# EasyEDA Pro project 三轴测试仪快速检测系统_2024-12-14.eprj, board PCB1
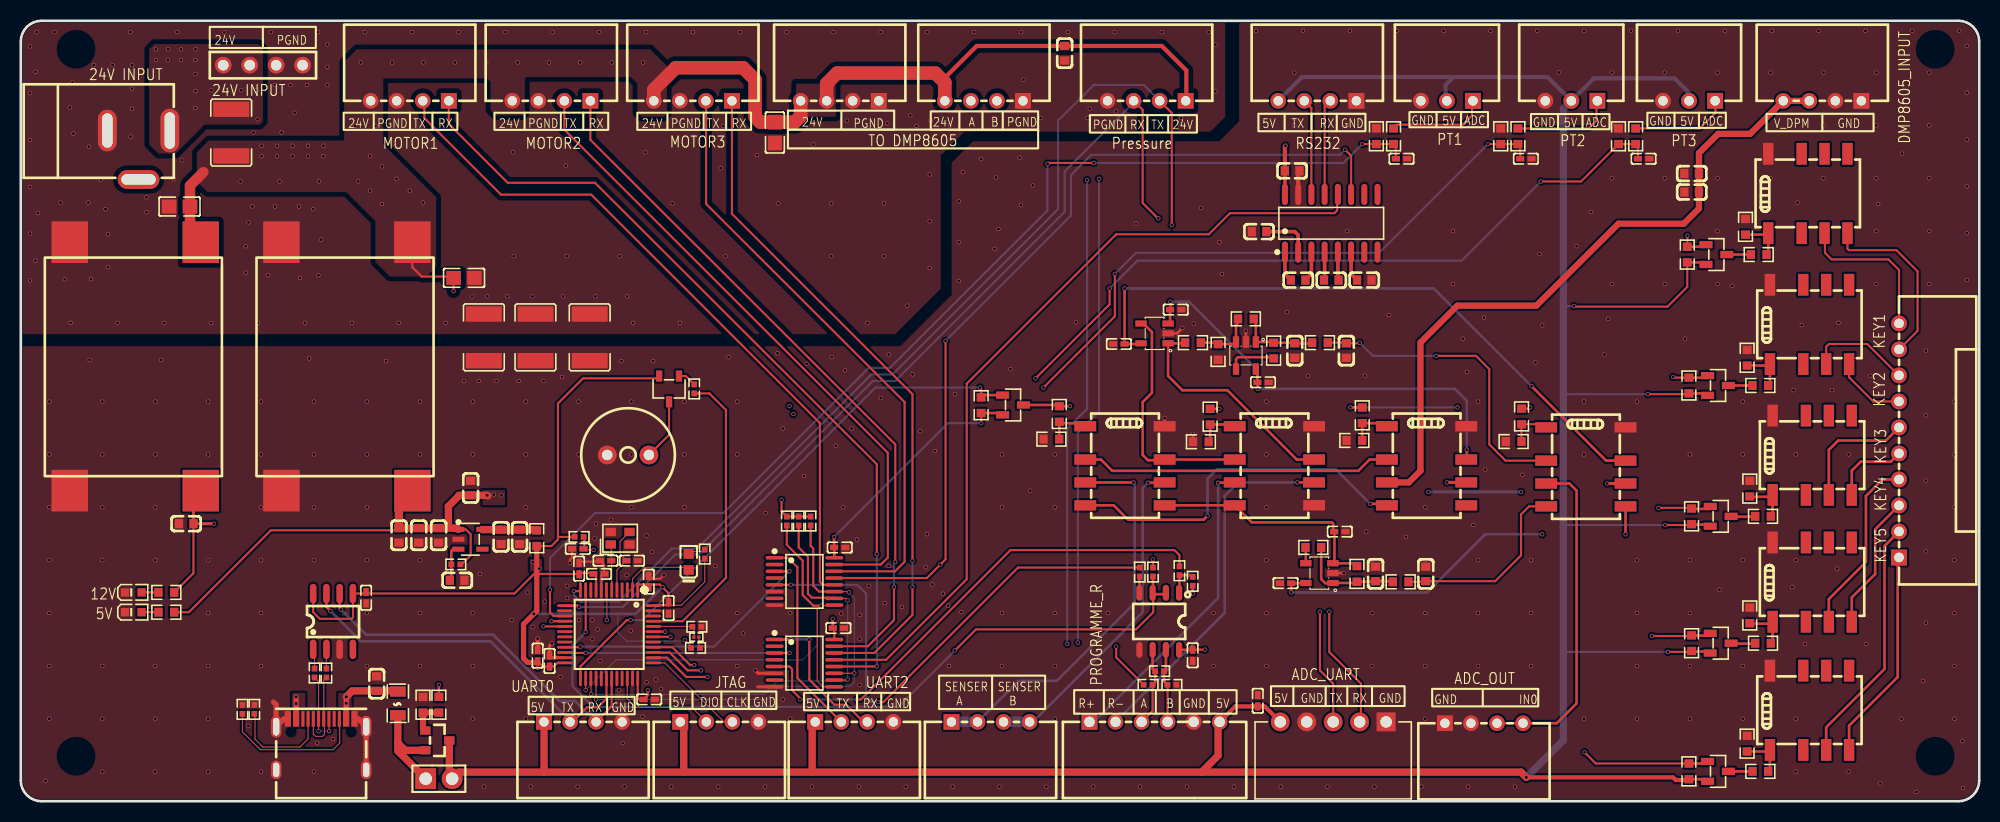
[diagram p6: board, top side]
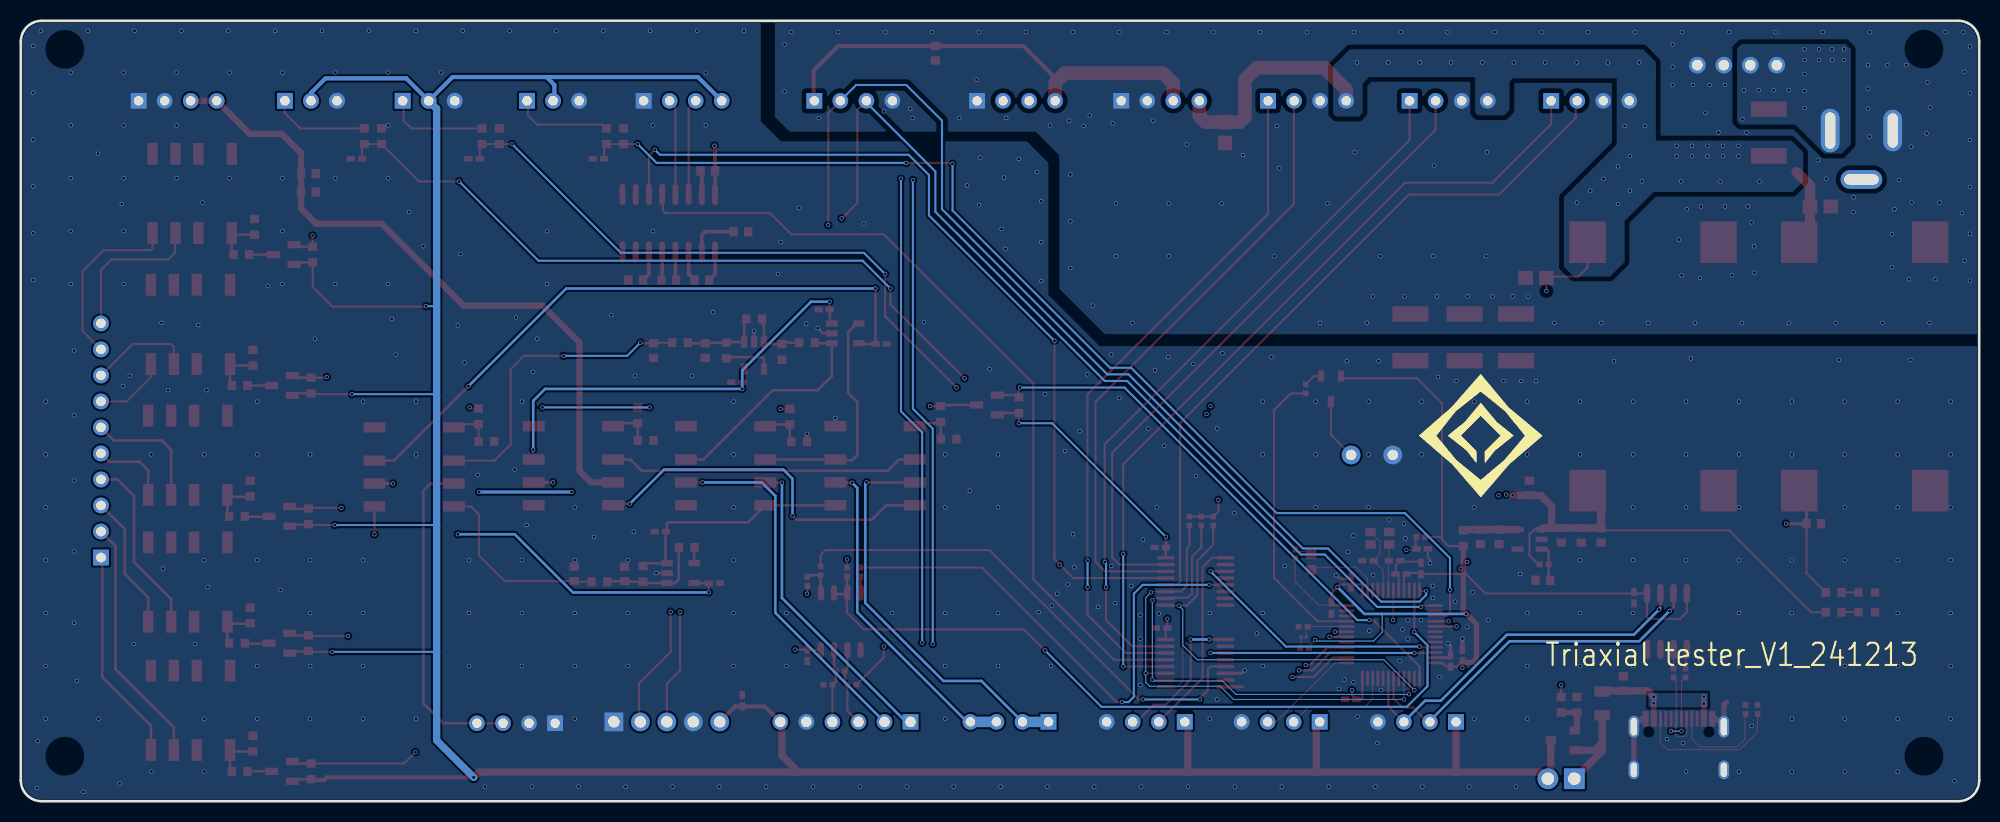
[diagram p7: board, bottom side, seen from below]

Outline 188 x 75 mm; copper layers: Top Layer, Inner1, Inner2, Bottom Layer. Coordinates in mm from the lower left corner of the outline.
Outline path: 0,73 0,2 arc(0.59,0.59) 2,0 186,0 arc(187.41,0.59) 188,2 188,73 arc(187.41,74.41) 186,75 2,75 arc(0.59,74.41) 0,73
Stack: Top Layer 0.035mm 外层铜厚1oz / Dielectric1 0.2104mm 7628 RC49% 8.6mil / Inner1 0.0152mm 内层铜厚 / Dielectric2 1.065mm 1.1mm H/HOZ Copper / Inner2 0.0152mm 内层铜厚 / Dielectric3 0.2104mm 7628 RC49% 8.6mil / Bottom Layer 0.035mm 外层铜厚1oz

## Design rules (mm)
template: 自定义配置
spacing copperThickness1oz (default): track to track 0.102, other pairs 0.152 to 0.3
spacing copperThickness2oz: track to track 0.203, other pairs 0.152 to 0.3
track width copperThickness1oz (default): min 0.09, default 0.2, max 4
track width copperThickness2oz: min 0.203, default 0.254, max 2.54
differential pair differentialPair (default): width min 0.127, default 0.254, max 2.54; gap min 0.152, default 0.152
via viaSize (default): diameter min 0.3, default 0.405, max 10; hole min 0.3, default 0.305, max 6.3
net GND uses PGND
net PGND uses PGND-爬电
net $3N960 uses PGND-爬电

## Placement (name value [footprint] x y rotation side)
BUZZER1  2.7kHz  [BUZ-TH_BD9.0-P4.00-D0.6-FD]  58.29 33.27 180 top
C101  100nF  [C0402]  105.41 43.94 0 top
C102  100nF  [C0402]  119.25 40.26 180 top
C103  100nF  [C0402]  110.87 47.24 180 top
C104  100nF  [C0603]  122.3 43.31 90 top
C105  100nF  [C0603]  127.25 43.31 90 top
C106  100nF  [C0402]  121.41 20.95 0 top
C107  100nF  [C0603]  130.05 21.84 270 top
C108  100nF  [C0603]  134.87 21.84 270 top
C201  100nF  [C0402]  78.61 24.38 0 top
C202  100nF  [C0402]  112.5 14.02 90 top
C203  100nF  [C0402]  78.49 16.64 0 top
C204  220nF  [C0603]  122.05 60.58 0 top
C205  220nF  [C0603]  118.87 54.74 0 top
C206  220nF  [C0603]  122.62 50.08 180 top
C207  220nF  [C0603]  125.8 50.08 180 top
C208  220nF  [C0603]  128.97 50.08 0 top
C301  10nF  [C0603]  40.11 25.55 270 top
C302  10uF  [C0603]  36.3 25.55 270 top
C303  100nF  [C0603]  38.2 25.55 270 top
C304  10uF  [C0603]  46.1 25.4 270 top
C305  100nF  [C0603]  47.88 25.4 270 top
C306  2.2uF  [C0603]  41.89 21.23 180 top
C401  100nF  [C0402]  60.28 21.1 270 top
C402  100nF  [C0402]  62.19 18.56 270 top
C403  1uF  [C0402]  53.59 22.35 270 top
C404  10nF  [C0402]  55.5 21.84 180 top
C405  100nF  [C0402]  60.33 9.78 180 top
C406  4.7uF  [C0402]  49.61 13.99 270 top
C407  100nF  [C0402]  50.75 13.48 270 top
C408  20pF  [C0402]  58.67 23.11 0 top
C409  20pF  [C0402]  56.13 23.11 0 top
C410  100nF  [C0402]  53.47 24.26 0 top
C501  100nF  [C0603]  34.16 11.3 90 top
C502  100nF  [C0402]  33.15 19.56 90 top
C503  100nF  [C0402]  132.54 61.75 180 top
C504  100nF  [C0805]  42.55 50.29 180 top
C505  100nF  [C0603]  43.18 30.1 270 top
C506  100nF  [C0603]  100.2 71.88 270 top
C507  100nF  [C0402]  118.75 9.65 90 top
C508  100nF  [C0603]  160.4 58.55 180 top
C509  10nF  [C0603]  160.4 60.33 180 top
C510  100nF  [C0603]  15.88 26.67 0 top
C511  100nF  [C0805]  15.24 57.15 0 top
C512  100nF  [C0402]  144.48 61.75 180 top
C513  100nF  [C0402]  155.79 61.75 180 top
C514  10uF  [C0805]  72.39 64.26 270 top
C515  100nF  [C0402]  126.62 25.91 0 top
CN2  ZX-HA2.54-10PWZ  [CONN-TH_10P-P2.50_ZX-HA2.54-10PWZ]  180.31 34.67 90 top
D401  绿灯 0603  [0603_LED_S1]  64.12 22.99 90 top
D402  XL-1608PGC-06  [LED0603-RD_GREEN]  10.8 20.07 0 top
D403  XL-1608PGC-06  [LED0603-RD_GREEN]  10.8 18.16 0 top
DC302  DC-005-5A-2.5  [DC-IN-TH_DC-005-5A-2.5]  11.3 62.1 0 top
F501  SL0805150 6V 1.5A  [F0805]  36.2 9.4 90 top
H501  WAFER-XH2.54-3PWZ  [CONN-TH_3P-P2.50_WAFER-XH2.54-3PWZ]  136.91 67.31 180 top
H502  PZ254V-11-02P  [HDR-TH_2P-P2.54-V-M]  40.13 2.16 0 top
H503  XH-5AW  [CONN-TH_5P-P2.54_XH-5AW_C2908614]  125.98 7.62 180 top
H504  ZX-XH2.54-6PWZ  [CONN-TH_6P-P2.50_ZX-XH2.54-6PWZ]  108.84 7.62 0 top
H505  WAFER-XH2.54-3PWZ  [CONN-TH_3P-P2.50_WAFER-XH2.54-3PWZ]  148.84 67.31 180 top
H506  WAFER-XH2.54-3PWZ  [CONN-TH_3P-P2.50_WAFER-XH2.54-3PWZ]  160.15 67.31 180 top
K101  G6K-2F-Y-TR DC5  [RELAY-SMD_G6K-2F-X-XX]  106 32.24 270 top
K102  G6K-2F-Y-TR DC5  [RELAY-SMD_G6K-2F-X-XX]  120.34 32.24 270 top
K103  G6K-2F-Y-TR DC5  [RELAY-SMD_G6K-2F-X-XX]  134.95 32.24 270 top
K601  G6K-2F-Y-TR DC5  [RELAY-SMD_G6K-2F-X-XX]  171.56 58.4 0 top
K602  G6K-2F-Y-TR DC5  [RELAY-SMD_G6K-2F-X-XX]  171.71 45.82 0 top
K603  G6K-2F-Y-TR DC5  [RELAY-SMD_G6K-2F-X-XX]  171.97 33.25 0 top
K604  G6K-2F-Y-TR DC5  [RELAY-SMD_G6K-2F-X-XX]  171.97 21.05 0 top
K605  G6K-2F-Y-TR DC5  [RELAY-SMD_G6K-2F-X-XX]  171.71 8.74 0 top
K606  G6K-2F-Y-TR DC5  [RELAY-SMD_G6K-2F-X-XX]  150.24 32.13 270 top
L3  YI453215U121-8R0T  [IND-SMD_L4.5-W3.2-CBW453215U800T]  20.19 64.26 270 top
L6  YI453215U121-8R0T  [IND-SMD_L4.5-W3.2-CBW453215U800T]  44.45 44.58 270 top
L7  YI453215U121-8R0T  [IND-SMD_L4.5-W3.2-CBW453215U800T]  49.4 44.58 270 top
L8  YI453215U121-8R0T  [IND-SMD_L4.5-W3.2-CBW453215U800T]  54.61 44.58 270 top
P301  HC06  [HDR-TH_4P-P2.54-V-F-R1-C4]  23.24 70.74 0 top
P302  ZX-XH2.54-4PWZ  [CONN-TH_4P-P2.50_ZX-XH2.54-4PWZ]  78.61 67.31 180 top
P303  ZX-XH2.54-4PWZ  [CONN-TH_4P-P2.50_ZX-XH2.54-4PWZ]  172.94 67.31 180 top
P501  ZX-XH2.54-4PWZ  [CONN-TH_4P-P2.50_ZX-XH2.54-4PWZ]  93.09 7.62 0 top
P502  ZX-XH2.54-4PWZ  [CONN-TH_4P-P2.50_ZX-XH2.54-4PWZ]  108.08 67.31 180 top
P503  ZX-XH2.54-4PWZ  [CONN-TH_4P-P2.50_ZX-XH2.54-4PWZ]  140.46 7.49 0 top
P504  ZX-XH2.54-4PWZ  [CONN-TH_4P-P2.50_ZX-XH2.54-4PWZ]  53.97 7.62 0 top
P505  ZX-XH2.54-4PWZ  [CONN-TH_4P-P2.50_ZX-XH2.54-4PWZ]  67.06 7.62 0 top
P506  ZX-XH2.54-4PWZ  [CONN-TH_4P-P2.50_ZX-XH2.54-4PWZ]  80.01 7.62 0 top
P507  ZX-XH2.54-4PWZ  [CONN-TH_4P-P2.50_ZX-XH2.54-4PWZ]  92.46 67.31 180 top
P508  ZX-XH2.54-4PWZ  [CONN-TH_4P-P2.50_ZX-XH2.54-4PWZ]  124.46 67.31 180 top
P509  ZX-XH2.54-4PWZ  [CONN-TH_4P-P2.50_ZX-XH2.54-4PWZ]  37.34 67.31 180 top
P510  ZX-XH2.54-4PWZ  [CONN-TH_4P-P2.50_ZX-XH2.54-4PWZ]  50.93 67.31 180 top
P511  ZX-XH2.54-4PWZ  [CONN-TH_4P-P2.50_ZX-XH2.54-4PWZ]  64.52 67.31 180 top
Q1  S8550  [SOT-23-3_L2.9-W1.6-P1.90-LS2.8-BR]  62.23 39.62 90 top
Q101  SI2301-ZE  [SOT-23-3_L2.9-W1.3-P1.90-LS2.4-BR]  95.25 38.08 180 top
Q501  SI2309  [SOT-23_L2.9-W1.3-P1.90-LS2.4-BR]  39.98 5.84 180 top
Q601  SI2301-ZE  [SOT-23-3_L2.9-W1.3-P1.90-LS2.4-BR]  162.77 52.53 180 top
Q602  SI2301-ZE  [SOT-23-3_L2.9-W1.3-P1.90-LS2.4-BR]  162.93 39.95 180 top
Q603  SI2301-ZE  [SOT-23-3_L2.9-W1.3-P1.90-LS2.4-BR]  163.18 27.38 180 top
Q604  SI2301-ZE  [SOT-23-3_L2.9-W1.3-P1.90-LS2.4-BR]  163.18 15.19 180 top
Q605  SI2301-ZE  [SOT-23-3_L2.9-W1.3-P1.90-LS2.4-BR]  162.93 2.87 180 top
R7  4.7kΩ  [R0402]  64.64 39.62 270 top
R101  0Ω  [R0603]  117.6 46.36 0 top
R102  1kΩ  [R0603]  120.27 43.31 90 top
R103  10kΩ  [R0603]  112.52 44.07 180 top
R104  0Ω  [R0603]  124.71 44.07 0 top
R105  100kΩ  [R0603]  92.19 38.06 270 top
R106  10kΩ  [R0603]  114.94 43.18 90 top
R107  100kΩ  [R0603]  98.93 34.8 180 top
R108  100kΩ  [R0603]  113.28 34.54 180 top
R109  100kΩ  [R0603]  128.02 34.67 180 top
R110  10Ω  [R0603]  99.69 37.21 270 top
R111  10Ω  [R0603]  114.17 36.96 270 top
R112  10Ω  [R0603]  128.78 37.08 270 top
R113  1kΩ  [R0603]  124.08 24.38 0 top
R115  0Ω  [R0603]  132.46 21.08 0 top
R118  0Ω  [R0603]  128.27 21.84 270 top
R203  10kΩ  [R0402]  112.5 21.13 270 top
R204  120Ω  [R0402]  111.23 22.15 270 top
R205  10kΩ  [R0402]  108.69 22.02 270 top
R206  1kΩ  [R0402]  110.5 11.19 0 top
R207  120Ω  [R0402]  109.32 12.5 180 top
R208  1kΩ  [R0402]  108.22 11.19 0 top
R209  120Ω  [R0402]  107.42 22.02 270 top
R301  0Ω  [R0603]  49.53 25.27 270 top
R302  30kΩ  [R0402]  41.76 22.76 180 top
R401  1kΩ  [R0402]  64.77 14.73 0 top
R402  10kΩ  [R0201]  64.85 15.77 180 top
R403  10kΩ  [R0402]  64.9 16.76 0 top
R404  1kΩ  [R0402]  65.66 23.75 90 top
R405  10kΩ  [R0402]  53.59 25.4 0 top
R501  5.1kΩ  [R0402]  22.42 8.83 270 top
R502  5.1kΩ  [R0402]  21.27 8.83 270 top
R503  0Ω  [R0402]  28.19 12.32 270 top
R504  0Ω  [R0402]  29.34 12.32 270 top
R505  10kΩ  [R0603]  131.78 63.9 90 top
R506  10kΩ  [R0603]  130.13 63.9 270 top
R507  1MΩ  [R0603]  40.13 9.27 90 top
R508  1MΩ  [R0603]  38.61 9.27 270 top
R601  10kΩ  [R0603]  159.98 52.53 270 top
R602  10kΩ  [R0603]  160.14 39.95 270 top
R603  10kΩ  [R0603]  160.39 27.38 270 top
R604  100kΩ  [R0603]  165.57 55.2 90 top
R605  100kΩ  [R0603]  165.72 42.62 90 top
R606  100kΩ  [R0603]  165.98 30.04 90 top
R607  10Ω  [R0603]  166.84 52.53 0 top
R608  10Ω  [R0603]  166.99 39.95 0 top
R609  10Ω  [R0603]  167.25 27.38 0 top
R610  10kΩ  [R0603]  160.39 15.19 270 top
R611  10kΩ  [R0603]  160.14 2.87 270 top
R612  100kΩ  [R0603]  165.98 17.85 90 top
R613  100kΩ  [R0603]  165.72 5.53 90 top
R614  10Ω  [R0603]  167.25 15.19 0 top
R615  10Ω  [R0603]  166.99 2.87 0 top
R616  10Ω  [R0603]  144.07 36.98 270 top
R617  100kΩ  [R0603]  143.31 34.57 180 top
R618  10kΩ  [R0603]  143.72 63.9 90 top
R619  10kΩ  [R0603]  142.07 63.9 270 top
R620  10kΩ  [R0603]  155.02 63.9 90 top
R621  10kΩ  [R0603]  153.37 63.9 270 top
R622  5.1kΩ  [R0603]  13.97 20.07 180 top
R623  5.1kΩ  [R0603]  13.97 18.16 180 top
R624  4.7kΩ  [R0402]  75.82 26.92 90 top
R625  4.7kΩ  [R0402]  74.68 26.92 90 top
R626  4.7kΩ  [R0402]  73.53 26.92 90 top
U101  TLV2371IDBVR  [SOT-23-5_L3.0-W1.7-P0.95-LS2.8-BR]  108.84 44.96 0 top
U102  TLV2371IDBVR  [SOT-23-5_L3.0-W1.7-P0.95-LS2.8-BR]  117.61 42.83 90 top
U103  TLV2371IDBVR  [SOT-23-5_L3.0-W1.7-P0.95-LS2.8-BR]  124.66 21.92 0 top
U202  RS2251XTSS16  [TSSOP-16_L5.0-W4.4-P0.65-LS6.4-BL]  75.23 21.12 270 top
U203  SP3485EEN  [SOP-8_L5.0-W3.9-P1.27-LS6.0-BL]  109.29 17.29 180 top
U204  RS2251XTSS16  [TSSOP-16_L5.0-W4.4-P0.65-LS6.4-BL]  75.23 13.27 270 top
U205  SP3232EEN  [SOP-16_L9.9-W3.9-P1.27-LS6.0-BL]  125.8 55.54 0 top
U301  -  [DCDC_24-5]  39.62 31.24 90 top
U302  SPX3819M5-L-3-3/TR  [SOT-23-5_L3.0-W1.7-P0.95-LS2.8-BL]  43.16 25.17 270 top
U401  GD32E103CBT6  [LQFP-48_L7.0-W7.0-P0.50-LS9.0-BL]  56.47 16.05 180 top
U501  CH340N  [SOP-8_L4.9-W3.9-P1.27-LS6.0-BL]  29.97 17.27 0 top
U505  -  [DCDC_24-5]  19.3 31.24 90 top
USB501  TYPE-C16PIN  [type-c16pin]  28.83 5.46 0 top
X401  25MHz  [OSC-SMD_4P-L2.0-W1.6-BL]  57.53 25.27 0 top

## Footprints (pads in the part's own frame, mm; a bottom-side part is the same pattern mirrored in y, then rotated)
0603_LED_S1
  rect 0.93x0.98 smd: A(0.77,0) K(-0.77,0)
BUZ-TH_BD9.0-P4.00-D0.6-FD
  round 1.8 hole 1: 1(-2,0) 2(2,0)
C0402
  rect 0.79x0.54 smd: 1(-0.545,0) 2(0.545,0)
C0603
  rect 0.8x0.9 smd: 1(-0.7,0) 2(0.7,0)
C0805
  rect 1.41x1.35 smd: 1(-1,0) 2(1,0)
CONN-TH_3P-P2.50_WAFER-XH2.54-3PWZ
  rect 1.524x1.524 hole 0.914: 1(-2.5,0)
  round 1.524 hole 0.914: 2(0,0) 3(2.5,0)
CONN-TH_4P-P2.50_ZX-XH2.54-4PWZ
  rect 1.524x1.5 hole 0.9: 1(-3.75,0)
  round 1.5 hole 0.9: 2(-1.25,0) 3(1.25,0) 4(3.75,0)
CONN-TH_5P-P2.54_XH-5AW_C2908614
  rect 1.8x1.8 hole 1.1: 1(-5.08,0)
  round 1.8 hole 1.1: 2(-2.54,0) 3(0,0) 4(2.54,0) 5(5.08,0)
CONN-TH_6P-P2.50_ZX-XH2.54-6PWZ
  rect 1.524x1.5 hole 1: 1(-6.25,0)
  round 1.5 hole 1: 2(-3.75,0) 3(-1.25,0) 4(1.25,0) 5(3.75,0) 6(6.25,0)
CONN-TH_10P-P2.50_ZX-HA2.54-10PWZ
  rect 1.524x1.524 hole 0.914: 1(-11.25,0)
  round 1.524 hole 0.914: 2(-8.75,0) 3(-6.25,0) 4(-3.75,0) 5(-1.25,0) 6(1.25,0) 7(3.75,0) 8(6.25,0) 9(8.75,0) 10(11.25,0)
DC-IN-TH_DC-005-5A-2.5
  oval 1.8x4.2 hole 1x3.5: 1(3,2.352)
  oval 1.8x4 hole 1x3.3: 2(-3,2.352)
  oval 4x1.8 hole 3.3x1: 3(-0.001,-2.352)
DCDC_24-5
  rect 4x3.5 smd: 1(22.479,14.605) 2(22.479,2.032) 3(-1.397,14.605) 4(-1.397,2.032)
F0805
  rect 1x1.5 smd: 1(-1.143,0) 2(1.143,0)
HDR-TH_2P-P2.54-V-M
  rect 2x2 hole 1.2: 1(-1.27,0)
  round 2 hole 1.2: 2(1.27,0)
HDR-TH_4P-P2.54-V-F-R1-C4
  round 1.6 hole 1.02: 1(-3.81,0) 2(-1.27,0) 3(1.27,0) 4(3.81,0)
IND-SMD_L4.5-W3.2-CBW453215U800T
  rect 1.485x3.456 smd: 1(-2.243,0) 2(2.243,0)
LED0603-RD_GREEN
  rect 0.8x0.8 smd: 1(-0.799,-0.004) 2(0.799,0.004)
LQFP-48_L7.0-W7.0-P0.50-LS9.0-BL
  oval 0.27x1.5 smd: 1(-2.75,-4.25) 2(-2.25,-4.25) 3(-1.75,-4.25) 4(-1.25,-4.25) 5(-0.75,-4.25) 6(-0.25,-4.25) 7(0.25,-4.25) 8(0.75,-4.25) 9(1.25,-4.25) 10(1.75,-4.25) 11(2.25,-4.25) 12(2.75,-4.25) 25(2.75,4.25) 26(2.25,4.25) 27(1.75,4.25) 28(1.25,4.25) 29(0.75,4.25) 30(0.25,4.25) 31(-0.25,4.25) 32(-0.75,4.25) 33(-1.25,4.25) 34(-1.75,4.25) 35(-2.25,4.25) 36(-2.75,4.25)
  oval 1.5x0.27 smd: 13(4.25,-2.75) 14(4.25,-2.25) 15(4.25,-1.75) 16(4.25,-1.25) 17(4.25,-0.75) 18(4.25,-0.25) 19(4.25,0.25) 20(4.25,0.75) 21(4.25,1.25) 22(4.25,1.75) 23(4.25,2.25) 24(4.25,2.75) 37(-4.25,2.75) 38(-4.25,2.25) 39(-4.25,1.75) 40(-4.25,1.25) 41(-4.25,0.75) 42(-4.25,0.25) 43(-4.25,-0.25) 44(-4.25,-0.75) 45(-4.25,-1.25) 46(-4.25,-1.75) 47(-4.25,-2.25) 48(-4.25,-2.75)
OSC-SMD_4P-L2.0-W1.6-BL
  rect 1x0.8 smd: 1(-0.9,-0.6) 2(0.9,-0.6) 3(0.9,0.6) 4(-0.9,0.6)
R0201
  rect 0.303x0.324 smd: 1(-0.241,0) 2(0.241,0)
R0402
  rect 0.566x0.54 smd: 1(-0.433,0) 2(0.433,0)
R0603
  rect 0.806x0.864 smd: 1(-0.753,0) 2(0.753,0)
RELAY-SMD_G6K-2F-X-XX
  rect 1x2.1 smd: 1(-3.8,-3.81) 2(-0.6,-3.81) 3(1.6,-3.81) 4(3.8,-3.81) 5(3.8,3.81) 6(1.6,3.81) 7(-0.6,3.81) 8(-3.8,3.81)
SOP-8_L4.9-W3.9-P1.27-LS6.0-BL
  oval 0.63x1.865 smd: 1(-1.905,-2.683) 2(-0.635,-2.683) 3(0.635,-2.683) 4(1.905,-2.683) 5(1.905,2.683) 6(0.635,2.683) 7(-0.635,2.683) 8(-1.905,2.683)
SOP-8_L5.0-W3.9-P1.27-LS6.0-BL
  oval 0.6x1.52 smd: 1(-1.905,-2.74) 2(-0.635,-2.74) 3(0.635,-2.74) 4(1.905,-2.74) 5(1.905,2.74) 6(0.635,2.74) 7(-0.635,2.74) 8(-1.905,2.74)
SOP-16_L9.9-W3.9-P1.27-LS6.0-BL
  oval 0.574x2.038 smd: 1(-4.445,-2.769) 2(-3.175,-2.769) 3(-1.905,-2.769) 4(-0.635,-2.769) 5(0.635,-2.769) 6(1.905,-2.769) 7(3.175,-2.769) 8(4.445,-2.769) 9(4.445,2.769) 10(3.175,2.769) 11(1.905,2.769) 12(0.635,2.769) 13(-0.635,2.769) 14(-1.905,2.769) 15(-3.175,2.769) 16(-4.445,2.769)
SOT-23-3_L2.9-W1.3-P1.90-LS2.4-BR
  rect 1.25x0.7 smd: 1(1,-0.95) 2(1,0.95) 3(-1,0)
SOT-23-3_L2.9-W1.6-P1.90-LS2.8-BR
  rect 1.07x0.6 smd: 1(1.235,-0.95) 2(1.235,0.95) 3(-1.235,0)
SOT-23-5_L3.0-W1.7-P0.95-LS2.8-BL
  rect 0.49x1.157 smd: 1(-0.95,-1.153) 2(0,-1.153) 3(0.95,-1.153)
  rect 0.49x1.175 smd: 4(0.95,1.153) 5(-0.95,1.153)
SOT-23-5_L3.0-W1.7-P0.95-LS2.8-BR
  rect 1.1x0.6 smd: 1(1.3,-0.95) 2(1.3,0) 3(1.3,0.95) 4(-1.3,0.95) 5(-1.3,-0.95)
SOT-23_L2.9-W1.3-P1.90-LS2.4-BR
  rect 1x0.8 smd: 1(1.15,-0.95) 2(1.15,0.95) 3(-1.15,0)
TSSOP-16_L5.0-W4.4-P0.65-LS6.4-BL
  oval 0.343x1.732 smd: 1(-2.275,-2.866) 2(-1.625,-2.866) 3(-0.975,-2.866) 4(-0.325,-2.866) 5(0.325,-2.866) 6(0.975,-2.866) 7(1.625,-2.866) 8(2.275,-2.866) 9(2.275,2.866) 10(1.625,2.866) 11(0.975,2.866) 12(0.325,2.866) 13(-0.325,2.866) 14(-0.975,2.866) 15(-1.625,2.866) 16(-2.275,2.866)
type-c16pin
  oval 1x2.099 hole 0.6x1.7: 1(-4.32,1.698) 2(4.32,1.698)
  oval 1x1.798 hole 0.6x1.4: 3(-4.32,-2.451) 4(4.32,-2.451)
  rect 0.6x1.5 smd: A1B12(-3.2,2.451) A4B9(-2.4,2.451) B1A12(3.2,2.451) B4A9(2.4,2.451)
  rect 0.3x1.5 smd: A5(-1.25,2.451) A6(-0.25,2.451) A7(0.25,2.451) A8(-1.75,2.451) B5(1.75,2.451) B6(0.75,2.451) B7(-0.75,2.451) B8(1.25,2.451)

## Nets
As in the schematic.

Pads without a net: DC302 3; K103 5; K601 2 5 6 7; K602 2 5 6 7; K603 2 5 6 7; K604 2 5 6 7; K605 2 5 6 7; U202 2 4 7; U204 2 4 7; U205 7 8 9 10; U302 4; U401 3 4 10 14 18 19 20 29 32 33 41 46; U501 4; USB501 A8 B8

## Via types
v1: diameter 0.405, hole 0.305, Top Layer to Bottom Layer, 678 vias

## Routing (per net, layer and track width the routed paths; a pad name or vN(x,y) marks a point on that pad's centre or on a via; arc(x,y) is an arc through that point)
GND: length 33.1
  Top Layer w0.2: v1(52.7,22.88) 52.7,23.2 52.92,23.42 C410.1 ; v1(61.72,21.72) 61.38,21.38 60.28,21.38 ; 56,21.74 56,22.7 C409.1 55.5,23.02 53.59,23.02 ; 55.94,21.95 55.73,21.74 55.73,20.3 55.72,20.29
  Top Layer w0.25: 117.61,44.13 v1(117.61,45.21) ; v1(112.52,35.31) 112.53,35.3 R108.2 ; v1(111.51,45.47) 111,44.96 U101.2 ; 125.96,21.92 v1(127,21.92) ; K101.8 v1(109.81,36.83)
  Top Layer w0.3: U204.8 70.74,10.99 ; v1(50.99,15.17) 50.75,14.93 50.75,13.76 50.79,13.8 U401.23 ; U204.6 70.78,12.29 v1(70.5,12.57)
  Top Layer w0.4: 122.75,60.58 122.62,60.46 U205.15 ; C406.1 v1(49.61,15.62)
  Top Layer w0.5: 24.26,9.53 24.51,9.27 24.51,7.16 25.26,7.91 USB501.A1B12 ; 32.03,7.91 32.4,7.91 USB501.2 USB501.4
  vias: v1(2.36,1.96) v1(2.74,38.41) v1(2.74,33.33) v1(2.74,28.25) v1(2.74,23.17) v1(2.74,18.09) v1(2.74,13.01) v1(2.74,7.93) v1(6.6,42.42) v1(7.82,38.41) v1(7.82,33.33) v1(7.82,28.25) v1(7.82,23.17) v1(7.82,18.09) v1(7.82,13.01) v1(7.82,7.93) v1(7.82,2.85) v1(12.9,38.41) v1(12.9,33.33) v1(12.9,28.25) v1(12.9,23.17) v1(12.9,13.01) v1(12.9,7.93) v1(12.9,2.85) v1(13.46,42.42) v1(17.98,38.41) v1(17.98,33.33) v1(17.98,23.17) v1(17.98,18.09) v1(17.98,13.01) v1(17.98,7.93) v1(17.98,2.85) v1(21.84,7.24) v1(23.06,38.41) v1(23.06,33.33) v1(23.06,28.25) v1(23.06,23.17) v1(23.06,18.09) v1(23.06,13.01) v1(23.06,2.85) v1(27.69,42.55) v1(28.14,38.41) v1(28.14,33.33) v1(28.14,28.25) v1(28.14,23.17) v1(28.14,2.85) v1(28.45,5.59) v1(29.97,5.97) v1(33.22,38.41) v1(33.22,33.33) v1(33.22,28.25) v1(33.22,23.17) v1(33.22,18.09) v1(33.22,13.01) v1(35.05,42.29) v1(38.3,38.41) v1(38.3,33.33) v1(38.3,23.17) v1(38.3,18.09) v1(38.3,13.01) v1(42.55,40.39) v1(43.38,38.41) v1(43.38,33.33) v1(43.38,18.09) v1(43.38,13.01) v1(43.38,7.93) v1(43.97,40.39) v1(44.07,21.84) v1(44.45,1.4) v1(45.67,40.39) v1(47.12,17.4) v1(47.8,40.39) v1(48.46,38.41) v1(48.46,33.33) v1(48.46,28.25) v1(48.46,7.93) v1(48.64,20.07) v1(48.95,1.4) v1(49.15,16.76) v1(50.18,40.39) v1(50.29,19.18) v1(51.82,11.94) v1(51.94,40.77) v1(52.45,20.7) v1(52.45,19.51) v1(53.45,1.4) v1(53.54,38.41) v1(53.54,33.33) v1(53.59,17.4) v1(54.86,17.4) v1(54.86,15.62) v1(55.09,25.25) v1(55.22,26.67) v1(55.37,16.51) v1(55.63,13.46) v1(56.64,27.05) v1(57.4,10.67) v1(57.66,42.29) v1(57.78,5.59) v1(57.95,1.4) v1(58.17,21.72) v1(58.62,38.41) v1(58.62,33.33) v1(58.62,28.25) v1(58.55,16.38) v1(59.69,8.13) v1(60.07,25.53) v1(60.07,11.43) v1(60.58,23.96) v1(60.71,42.29) v1(60.96,11.68) v1(61.47,10.79) v1(62.45,1.4) v1(63.7,38.41) v1(63.7,33.33) v1(63.7,28.25) v1(66.67,22.61) v1(66.95,1.4) v1(67.95,42.67) v1(68.78,38.41) v1(68.78,33.33) v1(68.78,18.09) v1(68.78,13.01) v1(69.34,16.13) v1(71.5,27.69) v1(71.45,1.4) v1(72.64,43.05) v1(73.15,35.81) v1(73.15,9.78) v1(73.86,18.09) v1(73.86,7.93) v1(75.18,31.24) v1(75.44,42.04) v1(75.95,1.4) v1(77.85,42.67) v1(78.23,34.16) v1(78.74,18.03) v1(78.94,28.25) v1(79.12,41.4) v1(79.76,35.81) v1(80.26,25.15) v1(80.52,17.91) v1(80.52,15.6) v1(80.52,11.18) v1(80.45,1.4) v1(81.41,20.7) v1(82.55,38.73) v1(82.93,19.05) v1(83.31,42.93) v1(83.31,22.61) v1(84.58,18.67) v1(84.95,1.4) v1(85.6,41.02) v1(86.36,35.56) v1(86.87,22.48) v1(87,25.65) v1(87.5,20.83) v1(87.76,33.66) v1(88.52,19.94) v1(89.03,18.8) v1(89.1,13.01) v1(89.45,1.4) v1(89.66,39.12) v1(90.04,57.66) v1(90.04,53.72) v1(90.04,49.99) v1(90.3,18.16) v1(90.42,60.45) v1(92.2,61.72) v1(93.47,53.09) v1(93.6,59.94) v1(93.85,54.99) v1(93.95,1.4) v1(94.18,33.33) v1(94.18,28.25) v1(94.18,18.09) v1(94.18,13.01) v1(95,41.53) v1(95.88,61.85) v1(96.01,57.28) v1(96.9,29.84) v1(97.16,59.18) v1(98.45,1.4) v1(99.26,33.33) v1(99.26,28.25) v1(99.26,18.09) v1(99.26,13.01) v1(99.26,7.93) v1(101.29,46.03) v1(102.95,1.4) v1(104.34,18.09) v1(107.06,55.5) v1(107.45,1.4) v1(111.95,1.4) v1(112.6,45.9) v1(113.28,57.02) v1(114.5,18.09) v1(114.5,13.01) v1(115.06,53.72) v1(115.32,50.67) v1(116.45,1.4) v1(118.58,74.04) v1(119.58,38.41) v1(119.58,33.33) v1(119.58,28.25) v1(119.58,23.17) v1(119.58,18.09) v1(119.58,13.01) v1(120.95,1.4) v1(121.54,46.99) v1(122.25,70.03) v1(122.25,64.95) v1(123.08,74.04) v1(123.57,40.89) v1(125.45,1.4) v1(127.33,64.95) v1(127.33,54.79) v1(127.58,74.04) v1(129.03,40.89) v1(129.16,25.91) v1(129.74,23.17) v1(129.74,18.09) v1(129.74,13.01) v1(129.95,1.4) v1(131.32,46.74) v1(132.08,74.04) v1(132.97,25.4) v1(134.45,1.4) v1(134.82,28.25) v1(134.82,23.17) v1(134.82,18.09) v1(134.82,13.01) v1(134.82,7.93) v1(136.58,74.04) v1(137.49,54.79) v1(137.49,49.71) v1(138.43,44.45) v1(138.81,41.28) v1(138.95,1.4) v1(139.45,26.54) v1(139.9,38.41) v1(139.9,23.17) v1(139.9,18.09) v1(139.9,13.01) v1(140.46,46.48) v1(140.59,31.88) v1(141.08,74.04) v1(143.45,1.4) v1(144.15,31.37) v1(144.98,23.17) v1(144.98,18.09) v1(144.98,13.01) v1(145.41,42.16) v1(145.58,74.04) v1(145.8,52.58) v1(146.05,45.72) v1(147.65,70.03) v1(149.35,53.34) v1(150.08,74.04) v1(150.06,38.41) v1(150.06,33.33) v1(150.06,7.93) v1(150.75,56.64) v1(152.02,42.93) v1(152.4,46.36) v1(152.73,70.03) v1(152.73,64.95) v1(152.73,59.87) v1(152.73,49.71) v1(154.58,74.04) v1(155.14,38.41) v1(155.14,23.17) v1(155.14,18.09) v1(155.14,13.01) v1(155.14,7.93) v1(157.81,70.03) v1(157.81,59.87) v1(157.81,49.71) v1(159.08,74.04) v1(159.77,44.45) v1(160.22,33.33) v1(160.22,23.17) v1(160.22,18.09) v1(160.22,13.01) v1(160.22,7.93) v1(162.89,70.03) v1(162.89,59.87) v1(162.89,54.79) v1(162.89,49.71) v1(163.07,20.32) v1(163.58,74.04) v1(164.31,49.53) v1(165.3,38.41) v1(165.3,33.33) v1(165.3,23.17) v1(165.3,13.01) v1(165.3,7.93) v1(167.97,70.03) v1(167.97,59.87) v1(168.08,74.04) v1(170.05,20.57) v1(170.18,39.5) v1(170.38,33.33) v1(170.38,23.17) v1(170.38,7.93) v1(170.38,2.85) v1(170.56,57.53) v1(170.97,45.75) v1(171.27,15.11) v1(172.58,74.04) v1(173.05,70.03) v1(173.05,64.95) v1(173.05,59.87) v1(173.87,39.5) v1(174.37,22.35) v1(174.5,45.97) v1(175.46,33.33) v1(175.46,2.85) v1(177.08,74.04) v1(177.16,15.11) v1(177.55,40.89) v1(178.13,70.03) v1(178.13,64.95) v1(178.13,59.87) v1(178.13,54.79) v1(178.13,49.71) v1(178.18,39.88) v1(178.31,57.4) v1(178.51,1.7) v1(180.59,62.23) v1(180.54,7.93) v1(181.58,74.04) v1(181.99,0.89) v1(182.63,11.56) v1(182.88,43.31) v1(182.88,37.08) v1(182.88,30.82) v1(182.88,24) v1(182.88,17.14) v1(183.21,70.03) v1(183.21,64.95) v1(183.21,59.87) v1(183.21,54.79) v1(183.21,49.71) v1(185.62,38.41) v1(185.62,33.33) v1(185.62,28.25) v1(185.62,23.17) v1(185.62,18.09) v1(185.62,13.01) v1(185.62,7.93) v1(186.08,74.04) v1(186.38,5.77) v1(186.44,1.27) v1(186.82,72.59) v1(186.82,68.09) v1(186.82,63.59) v1(186.82,59.09) v1(186.82,54.59) v1(186.82,50.09)
PGND:
  vias: v1(0.89,72.54) v1(0.89,68.04) v1(0.89,63.54) v1(0.89,59.04) v1(0.89,54.54) v1(0.89,50.04) v1(1.4,70.1) v1(1.4,51.94) v1(1.52,73.91) v1(1.65,56.52) v1(3.23,73.91) v1(3.81,57.53) v1(4.22,50.17) v1(4.7,66.67) v1(4.78,45.97) v1(4.95,69.09) v1(5.05,64.17) v1(6.48,57.53) v1(6.53,62.9) v1(6.73,50.17) v1(7,70.74) v1(7.68,59.71) v1(8.13,56.9) v1(8.38,54.48) v1(8.38,51.32) v1(8.81,70.74) v1(9.28,45.97) v1(10.52,73.91) v1(10.54,63.88) v1(10.69,70.74) v1(10.69,68.48) v1(10.69,66.55) v1(12.06,58.04) v1(12.06,56.6) v1(13.78,45.97) v1(14.68,59.83) v1(15.02,73.91) v1(15.49,61.59) v1(18.28,45.97) v1(19.52,73.91) v1(21.59,53.33) v1(21.59,50.8) v1(21.84,55.63) v1(22.22,57.15) v1(22.33,64.26) v1(22.78,45.97) v1(23.75,50.55) v1(24.02,73.91) v1(24.38,68.83) v1(24.4,57.15) v1(25.03,64.26) v1(25.88,68.83) v1(26.29,66.17) v1(26.71,57.15) v1(26.8,50.29) v1(27.28,45.97) v1(27.46,68.83) v1(28.07,56.9) v1(28.52,73.91) v1(28.58,50.55) v1(28.83,53.97) v1(29.42,72.72) v1(29.42,70.58) v1(29.42,68.83) v1(31.78,45.97) v1(33.02,73.91) v1(36.28,45.97) v1(37.52,73.91) v1(40.78,45.97) v1(42.02,73.91) v1(43.31,48.51) v1(44.78,48.51) v1(46.52,73.91) v1(46.71,48.51) v1(47.24,62.36) v1(47.32,52.38) v1(49.12,48.51) v1(51.02,73.91) v1(52.06,48.51) v1(52.32,61.09) v1(52.4,52.38) v1(55.15,48.51) v1(55.52,73.91) v1(57.48,52.38) v1(58.21,48.51) v1(58.78,45.97) v1(60.02,73.91) v1(59.94,62.36) v1(62.56,57.46) v1(63.28,45.97) v1(64.52,73.91) v1(67.18,60.83) v1(67.44,64.9) v1(67.64,52.38) v1(69.02,73.91) v1(70.67,62.1) v1(72.72,57.46) v1(73.52,73.91) v1(76.07,63.12) v1(77.8,57.46) v1(77.8,52.38) v1(78.02,73.91) v1(79.31,65.41) v1(81.28,45.97) v1(82.52,73.91) v1(82.88,57.46) v1(82.88,52.38) v1(83.19,65.15) v1(85.09,47.63) v1(85.39,65.91) v1(85.98,64.9) v1(87.02,73.91) v1(87.25,60.23) v1(87.25,55.73) v1(87.25,51.23) v1(87.35,65.41) v1(89.2,64.94) v1(91.52,73.91) v1(93.4,65.66) v1(96.02,73.91) v1(96.27,69.34) v1(97.9,65.66) v1(100.52,73.91) v1(102.4,65.66) v1(102.62,66.55) v1(105.02,73.91) v1(105.16,66.29) v1(109.52,73.91) v1(111.4,65.66) v1(114.02,73.91) v1(114.68,72.72) v1(114.68,68.22)
VCC_3V3: length 307.2
  Top Layer w0.1: 62.19,18.84 63.41,18.84 65.66,21.08 65.66,23.51 ; v1(63.75,15.49) 64.34,14.91 R401.1
  Top Layer w0.2: 53.59,21.93 54.86,21.93 ; 53.59,21.84 49.68,21.84 49.53,21.69 ; U401.24 51.52,13.3 51.18,12.95 50.77,12.95 C407.2 50.12,12.94 C406.2 v1(49.61,12.83) ; C404.2 55.22,21.58 55.22,20.29 ; v1(49.78,22.35) 47.39,19.96 31.88,19.96 U501.5 31.89,19.94 31.89,17.67 31.75,17.53 28.7,17.53 28.07,18.16 28.07,19.95 ; Q1.2 61.06,40.64 53.97,40.64 51.56,38.23 51.56,25.43 ; 59.22,11.79 59.22,9.87 59.31,9.78 C405.2 60.2,10.2 v1(60.2,10.67) ; 51.56,25.43 51.56,25.15 50.94,24.52 R301.2 ; 51.56,25.43 51.59,25.4 R405.1 ; v1(105.16,14.86) 105.16,13.82 R208.1 ; U401.48 60.76,18.84 62.19,18.84 62.19,19.98 v1(61.59,20.57) 61.34,20.83 59.37,20.83 59.22,20.68 59.22,20.29 ; R205.1 v1(108.69,23.24) ; C202.2 v1(113.66,14.56)
  Top Layer w0.25: U203.8 112.48,14.55 C202.2 ; R203.2 112.5,19.96 v1(112.52,19.94)
  Top Layer w0.3: K103.6 v1(136.91,30.64)
  Top Layer w0.35: U205.16 121.35,60.57 C204.1
  Top Layer w0.4: C204.1 121.35,62.93 v1(121.41,62.99)
  Top Layer w0.5: 49.53,24.51 49.53,18.29 v1(49.24,18) 48.26,17.02 48.26,13.72 48.64,13.33 49.5,13.33 C406.2
  Inner1 w0.2: v1(60.2,10.67) 59.31,10.67 58.67,11.3 51.14,11.3 v1(49.61,12.83)
  Inner2 w0.25: 105.16,16.38 v1(105.16,14.86) ; v1(112.52,19.94) 112.52,16.89 112.01,16.38 ; v1(108.69,23.24) 108.86,23.06 108.86,16.38 ; 114.3,16.38 114.3,15.2 v1(113.66,14.56)
  Inner2 w0.4: v1(49.78,22.35) 52.07,22.35 53.34,21.08 69.85,21.08 74.55,16.38 134.49,16.38 136.91,18.8 v1(136.91,30.64) 136.91,58.8 134.37,61.34 123.06,61.34 v1(121.41,62.99)
  Bottom Layer w0.1: 57.31,18 57.31,16.22 58.14,15.39 63.65,15.39 v1(63.75,15.49)
  Bottom Layer w0.25: v1(49.24,18) 59.02,18 v1(61.59,20.57)
  vias: v1(49.15,22.99)
VCC_5V: length 473.4
  Top Layer w0.2: R601.2 159.98,49.42 158.08,47.53 149.14,47.53 v1(149.1,47.57) ; R603.2 160.31,26.54 v1(157.86,26.54) ; C302.1 36.08,26.03 24,26.03 16.13,18.16 R623.1 ; R610.2 160.31,14.35 v1(158.12,14.35) ; U302.1 42.71,26.12 43.18,25.65 43.18,23.62 42.32,22.76 R302.1 ; v1(156.21,39.12) 160.06,39.12 R602.2 ; U204.16 78.09,16.49 C203.1 ; R105.2 v1(92.19,36.32) ; v1(73.03,28.96) 73.03,27.86 73.53,27.36 75.82,27.36
  Top Layer w0.25: U202.16 78.09,24.36 C201.1 v1(78.07,25.4) ; C203.1 v1(77.94,17.53) ; R105.2 94.08,37.3 Q101.2 ; Q605.2 161.73,2.11 R611.2 ; 160.46,26.58 161.99,26.58 162.18,26.39 ; R602.2 161.73,39.2 Q602.2 ; 162.18,14.19 161.99,14.39 160.46,14.39 ; R601.2 161.57,51.78
  Top Layer w0.4: H504.6 116.58,9.11 C507.1 119.42,9.11 H503.5 ; v1(144.53,2.29) 158.62,2.29 158.88,2.03 160.06,2.03 R611.2
  Top Layer w0.7: 75.97,2.79 75.97,7.33 P506.1 ; 75.97,2.79 63.64,2.79 ; 75.97,2.79 113.35,2.79 ; 63.64,2.79 63.64,7.29 P505.1 ; 63.64,2.79 50.22,2.79 ; C302.1 C303.1 C301.1 41.05,26.25 ; 113.35,2.79 114.94,4.38 114.94,7.47 H504.6 ; 113.35,2.79 144.02,2.79 v1(144.53,2.29) ; 50.22,2.79 42.04,2.79 41.43,2.18 ; 50.22,2.79 P504.1 ; 41.43,2.18 41.13,2.48 Q501.3 ; 41.43,2.18 H502.2 ; 42.04,29.34 41.05,28.35 41.05,26.25 ; 41.05,26.25 41.87,26.25 U302.1 ; 42.04,29.4 C505.2 v1(44.77,29.4) 44.83,29.34
  Top Layer w0.8: C302.1 36.3,28.55 U301.4
  Inner1 w0.25: v1(78.07,25.4) 77.94,25.27 v1(77.94,17.53)
  Inner1 w0.7: v1(45.4,29.46) 45.4,6.16 H502.2
  Inner2 w0.4: 73.03,29.46 v1(73.03,28.96) ; 73.03,29.46 76.45,29.46 78.1,27.81 78.1,25.44 v1(78.07,25.4) ; 73.03,29.46 v1(45.4,29.46)
  Bottom Layer w0.2: 148.08,47.57 v1(149.1,47.57) ; 148.08,38.99 148.21,39.12 v1(156.21,39.12) ; 148.08,26.42 148.21,26.54 v1(157.86,26.54) ; 148.08,14.35 v1(158.12,14.35) ; v1(92.19,36.32) 88.99,36.32 v1(78.07,25.4)
  Bottom Layer w0.4: 137.54,69.6 136.78,68.83 136.78,67.44 H501.2 ; 137.54,69.6 146.56,69.6 H505.2 151,69.47 158.75,69.47 160.15,68.07 H506.2 ; 137.54,69.6 123,69.6 P508.4
  Bottom Layer w0.7: H505.2 148.08,66.55 148.08,5.84 v1(144.53,2.29)
  vias: v1(46.13,29.4)
VCC_12V: length 152.2
  Top Layer w0.2: R622.1 16.58,21.92 C510.2
  Top Layer w0.3: K606.6 v1(152.27,30.53) ; U505.4 16.58,29.15 C510.2 v1(18.54,26.67)
  Inner2 w0.3: v1(135.13,29.72) 132.33,32.51 73.79,32.51 73.15,31.88 33.4,31.88 28.19,26.67 v1(18.54,26.67) ; v1(144.02,29.72) 151.46,29.72 v1(152.27,30.53)
  Bottom Layer w0.3: v1(135.13,29.72) v1(144.02,29.72)
VCC_12V_OP1: length 61.9
  Top Layer w0.25: v1(145.03,39.88) 152.18,32.73 K606.7 ; 105.96,43.94 107.47,43.94 U101.5 ; 105.96,43.94 v1(105.96,49.28) ; 105.96,43.94 105.92,43.91
  Bottom Layer w0.25: v1(145.03,39.88) 135.64,49.28 v1(105.96,49.28)
VCC_12V_OP2: length 39.4
  Top Layer w0.25: K606.5 v1(154.05,25.65) ; v1(121.96,20.07) C106.2 123.34,20.95 U103.5
  Inner1 w0.25: v1(146.05,25.65) v1(154.05,25.65)
  Bottom Layer w0.25: v1(121.96,20.07) 135,20.07 140.59,25.65 v1(146.05,25.65)
VCC_24V: length 121.3
  Top Layer w0.2: v1(41.55,49.02) C504.2 41.42,50.42 38.48,50.42 37.59,51.31 U301.2
  Top Layer w0.25: R507.2 v1(40.13,11.18)
  Top Layer w0.4: 88.65,69.47 91.76,72.58 C506.1 109.54,72.58 111.89,70.23 111.89,67.37 P502.1
  Top Layer w1: 17.53,60.45 16.24,59.17 C511.2 16.24,54.75 U505.2
  Top Layer w1.3: P302.4 74.86,65.85 74.28,65.26 C514.1 70.99,65.26 70.48,65.77 70.48,69.34 69.34,70.48 62.86,70.48 60.77,68.39 P511.4 ; P507.4 88.71,69.06 87.79,69.98 78.36,69.98 77.36,68.98 P302.3
  Inner1 w0.2: v1(41.55,49.02) 41.55,12.59 v1(40.13,11.18)
  vias: v1(21.08,59.56) v1(23.11,62.99) v1(23.11,61.98) v1(24.6,62.99) v1(24.6,61.98) v1(24.85,59.56) v1(26.08,62.99) v1(26.08,61.98) v1(27.56,62.99) v1(27.56,61.98) v1(28.62,59.56) v1(29.05,62.99) v1(29.05,61.98) v1(32.08,64.9) v1(32.39,59.56) v1(32.64,70.99) v1(33.53,61.98) v1(33.53,58.67) v1(34.04,64.9) v1(34.67,61.01) v1(34.67,57.4) v1(35.65,70.99) v1(36.07,59.82) v1(37.34,58.67) v1(38.61,57.53) v1(38.66,70.99) v1(41.67,70.99) v1(44.68,70.99) v1(47.69,70.99) v1(50.7,70.99) v1(53.71,70.99) v1(56.72,70.99) v1(59.73,70.99)
VCC_DPM8605: length 66.1
  Top Layer w0.6: K103.3 133.25,30.64 134.37,31.75 134.37,44.08 137.91,47.62 145.49,47.62 153.37,55.5 159.64,55.5 161.1,56.96 C508.1 C509.1 161.1,62.3 162.94,64.14 166.02,64.14 P303.4 P303.3
VCC_DPM_1: length 29.9
  Top Layer w0.25: K103.2 129.48,32.84 128.4,31.75 104.78,31.75 103.69,32.84 K101.2
VCC_DPM_2: length 35
  Top Layer w0.25: v1(129.54,28.58) 131,28.58 K103.4 ; v1(113.92,27.43) 113.54,27.05 106.3,27.05 104.91,28.44 K101.4
  Bottom Layer w0.25: v1(113.92,27.43) 113.92,30.99 114.81,31.88 126.24,31.88 v1(129.54,28.58)
VCC_OP_1: length 43.3
  Top Layer w0.25: v1(110.36,48.01) 110.36,47.28 C103.2 110.33,46.09 U101.3 ; K103.7 138.81,32.89 v1(138.81,33.78) ; v1(118.75,39.62) 118.75,40.22 C102.2 118.71,41.38 U102.5
  Bottom Layer w0.25: v1(110.36,48.01) 112.14,48.01 118.75,41.4 v1(118.75,39.62) 137.67,39.62 138.81,38.48 v1(138.81,33.78)
485_DIR: length 74.7
  Top Layer w0.2: v1(54.23,16.26) 54.23,20.29 54.22,20.29 ; 108.66,19.9 108.71,19.84 108.71,18.16 107.06,16.51 91.69,16.51 v1(89.66,14.48)
  Top Layer w0.25: U203.3 108.69,20.06 R205.2 ; 109.93,19.9 108.66,19.9
  Bottom Layer w0.2: v1(89.66,14.48) 84.25,9.07 54.94,9.07 52.96,11.05 52.96,14.99 v1(54.23,16.26)
485_RX: length 48.7
  Top Layer w0.2: v1(74.8,9.78) 74.8,9.91 74.04,10.67 74.04,12.7 73.8,12.94 72.36,12.94 ; R204.1 111.23,23.65 110.74,24.13 95,24.13 80.65,9.78 v1(80.26,9.78)
  Bottom Layer w0.2: v1(80.26,9.78) v1(74.8,9.78)
485_TX: length 50.9
  Top Layer w0.2: U202.5 v1(73.91,20.79) ; R209.1 95.73,22.45 82.8,9.53 v1(82.3,9.53)
  Bottom Layer w0.2: v1(73.91,20.79) 80.3,20.79 81.15,19.94 81.15,10.03 81.66,9.53 v1(82.3,9.53)
ADC0: length 30
  Top Layer w0.2: R104.2 127.19,44.07 C105.2 128.46,44.01 v1(128.52,44.07) ; K606.2 142.53,32.73 140.97,34.29 140.97,41.53 139.7,42.8 v1(135.89,42.8)
  Bottom Layer w0.2: v1(128.52,44.07) 129.79,42.8 v1(135.89,42.8)
ADC1: length 18.5
  Top Layer w0.2: R115.2 134.81,21.08 C108.2 141.54,21.14 144.02,23.62 144.02,27.56 144.79,28.33 K606.4
BEEP: length 28.5
  Top Layer w0.2: 64.64,39.19 66.09,39.19 67.69,37.59 67.69,21.46 63.52,17.29 60.72,17.29
BOOT0: length 4.9
  Top Layer w0.1: 64.43,16.8 R403.1 ; 64.43,16.8 U401.44 ; 64.43,16.8 64.47,16.8 64.61,16.66 R402.2
DIVIDER_R_A: length 23.2
  Top Layer w0.25: R118.1 128.01,22.86 125.97,22.86 125.96,22.87 126.11,23.02 126.11,25.78 126.03,25.86 ; K101.5 K102.4 118.17,26.8 125.86,26.8 125.98,26.67 125.98,26 C515.1
IN0: length 32.1
  Top Layer w0.2: P503.3 P503.4
  Top Layer w0.25: K606.3 148.67,30.53 149.35,29.84 149.35,9.4 147.45,7.49 P503.4
IO_CONTROL: length 51.8
  Top Layer w0.2: v1(144.91,37.85) 144.79,37.73 R616.1
  Top Layer w0.25: R112.1 128.77,37.85 v1(127.63,37.85) ; R111.1 v1(115.06,37.71) ; v1(100.71,37.96) R110.1 99.58,38.08 Q101.3
  Inner2 w0.2: v1(100.71,37.96) 114.81,37.96 v1(115.06,37.71) 127.5,37.71 v1(127.63,37.85) ; v1(137.92,37.85) v1(144.91,37.85)
  Bottom Layer w0.2: v1(127.63,37.85) v1(137.92,37.85)
KEY1_A: length 14.8
  Top Layer w0.2: K601.3 173.19,54.56 173.19,52.7 173.83,52.07 179.29,52.07 180.31,51.05 CN2.10
KEY1_B: length 17.4
  Top Layer w0.2: CN2.9 182.09,45.2 182.09,50.93 180.05,52.96 175.48,52.96 175.36,53.08 K601.4
KEY1_CONTROL: length 2.3
  Top Layer w0.25: Q601.3 R607.1
KEY2_A: length 10
  Top Layer w0.2: K602.3 173.31,43.68 173.58,43.94 177.26,43.94 180.28,40.92 CN2.8
KEY2_B: length 7
  Top Layer w0.2: K602.4 175.51,40.73 177.83,38.42 CN2.7
KEY2_CONTROL: length 2.3
  Top Layer w0.25: Q602.3 R608.1
KEY3_A: length 12
  Top Layer w0.25: CN2.6 179.05,34.66 174.46,34.66 173.57,33.77 K603.3
KEY3_B: length 7.6
  Top Layer w0.25: K603.4 175.77,31.77 176.62,32.63 179.51,32.63 CN2.5
KEY3_CONTROL: length 2.3
  Top Layer w0.25: 164.18,27.34 166.49,27.34
KEY4_A: length 17.4
  Top Layer w0.25: CN2.4 178.72,30.92 177.13,29.34 177.13,22.99 173.57,19.42 K604.3
KEY4_B: length 13.1
  Top Layer w0.25: CN2.3 178.02,26.14 178.02,21.83 175.77,19.58 K604.4
KEY4_CONTROL: length 2.3
  Top Layer w0.25: 164.18,15.14 166.49,15.14
KEY5_A: length 23.9
  Top Layer w0.25: CN2.2 178.91,24.52 178.91,12.7 173.31,7.1 K605.3
KEY5_B: length 20.5
  Top Layer w0.25: K605.4 175.51,7.26 180.18,11.93 180.18,23.29 CN2.1
KEY5_CONTROL: length 2.3
  Top Layer w0.25: Q605.3 R615.1
LED_GREEN: length 7
  Top Layer w0.1: 58.72,20.29 58.72,21.38 59.82,22.48 63.86,22.48 D401.K
MCU_232_1_RX: length 78.7
  Top Layer w0.2: U204.13 83.06,13.59 90.81,21.34 90.81,40.13 105.16,54.48 114.05,54.48 116.08,56.52 126.11,56.52 126.37,56.77 126.37,58.24 U205.12
MCU_232_1_TX: length 85.2
  Top Layer w0.2: v1(127.13,62.62) 127.7,62.04 U205.11 ; v1(88.77,44.24) 88.77,23.24 v1(88.27,22.73) 86.98,21.44 U202.13
  Bottom Layer w0.2: v1(88.77,44.24) 100.82,56.29 100.82,60.18 102.77,62.13 126.64,62.13 v1(127.13,62.62)
MCU_IO_CONTROL: length 53.8
  Top Layer w0.2: 53.72,11.79 53.72,12.95 58.17,17.4 v1(58.55,17.4) ; R105.1 92.19,39.64 v1(92.07,39.75)
  Top Layer w0.25: Q101.1 92.41,39.03 R105.1
  Bottom Layer w0.2: v1(58.55,17.4) 59.69,17.4 82.04,39.75 v1(92.07,39.75)
MCU_IO_KEY1: length 123.1
  Top Layer w0.2: v1(159.99,54.36) 159.99,53.3 R601.1 ; 60.72,16.29 v1(61.85,16.29)
  Top Layer w0.25: R601.1 161.57,53.29
  Inner1 w0.2: v1(159.99,54.36) 148.41,54.36 141.93,60.83 106.39,60.83 v1(61.85,16.29)
MCU_IO_KEY2: length 134.6
  Top Layer w0.2: U401.42 v1(62.36,15.8) ; 158.61,40.7 R602.1
  Top Layer w0.25: R602.1 161.73,40.7 Q602.1
  Inner1 w0.2: v1(158.62,40.77) 148.55,40.77 143.76,45.55 143.76,57.4 141.1,60.07 106.63,60.07 v1(62.36,15.8)
MCU_IO_KEY3: length 152.9
  Top Layer w0.2: 157.26,28.13 157.32,28.19 160.33,28.19 R603.1 ; v1(64.64,13.08) 64.26,13.08 62.55,14.8 U401.40
  Top Layer w0.25: 160.39,28.09 161.99,28.09 162.18,28.29
  Inner1 w0.2: v1(157.23,28.19) 143.89,28.19 143,29.08 143,56.52 140.08,59.44 106.81,59.44 64.64,17.27 v1(64.64,13.08)
MCU_IO_KEY4: length 164
  Top Layer w0.2: v1(65.28,12.57) 64.01,12.57 62.29,14.3 U401.39 ; v1(156.59,15.88) 160.33,15.88 R610.1
  Top Layer w0.25: 162.18,16.09 161.99,15.9 R610.1
  Inner1 w0.2: v1(65.28,12.57) 65.28,17.02 106.93,58.67 139.7,58.67 142.37,56.01 142.37,17.91 144.4,15.88 v1(156.59,15.88)
MCU_IO_KEY5: length 171.4
  Top Layer w0.2: U401.38 62.02,13.8 63.88,11.94 v1(65.91,11.94) ; R611.1 151.19,3.62 v1(150.11,4.7)
  Top Layer w0.25: Q605.1 161.73,3.62 R611.1
  Inner1 w0.2: v1(150.11,4.7) 150.11,6.48 141.6,14.99 141.6,55.75 139.32,58.04 107.19,58.04 65.91,16.76 v1(65.91,11.94)
MOTOR_1_RX: length 80.4
  Top Layer w0.2: 78.09,12.94 82.16,12.94 v1(82.17,12.95) ; v1(82.17,23.75) 82.17,32.39 55.12,59.44 46.74,59.44 41.09,65.08 P509.1
  Bottom Layer w0.2: v1(82.17,23.75) v1(82.17,12.95)
MOTOR_1_TX: length 68.6
  Top Layer w0.2: P509.2 38.73,67.16 38.73,65.65 46.1,58.29 54.76,58.29 76.69,36.36 76.71,36.36 76.71,21.08 77,20.79 U202.12
MOTOR_2_RX: length 68.9
  Top Layer w0.2: v1(83.95,22.99) 83.95,34.29 54.68,63.56 P510.1 ; U204.15 81.31,14.89 83.82,17.4 v1(83.82,20.57)
  Bottom Layer w0.2: v1(83.95,22.99) 83.82,22.86 v1(83.82,20.57)
MOTOR_2_TX: length 62.2
  Top Layer w0.2: U202.15 82.56,22.74 83.23,23.41 83.23,33.48 52.18,64.54 P510.2
MOTOR_3_RX: length 65.6
  Top Layer w0.2: U204.14 81.93,14.24 85.6,17.91 v1(85.6,20.57) ; v1(85.6,23.11) 85.6,39.12 68.27,56.45 P511.1
  Bottom Layer w0.2: v1(85.6,23.11) v1(85.6,20.57)
MOTOR_3_TX: length 59.3
  Top Layer w0.2: U202.14 83.93,22.09 84.84,23 84.84,38.35 65.79,57.4 65.79,67.29 P511.2
NRST: length 12.4
  Top Layer w0.1: 56.22,20.29 56.26,20.25 v1(56.26,17.4) ; 54.09,24.35 54.3,24.15 v1(54.99,24.15)
  Top Layer w0.2: R405.2 54.09,25.33 54.09,24.15
  Inner1 w0.1: v1(54.99,24.15) 56.26,22.88 v1(56.26,17.4)
OAP_R_A: length 22.6
  Top Layer w0.25: K102.2 K101.7 109.74,32.77 108.2,32.77 107.7,33.27 107.7,38.35 108.59,39.24 108.59,45.08 107.76,45.91 U101.4
OAP_R_B: length 22.1
  Top Layer w0.25: K102.7 122.49,32.84 115.82,39.5 111.51,39.5 110.14,40.86 U101.1 111.71,44.01 R103.2
OSC_IN: length 6.2
  Top Layer w0.1: 57.22,20.29 57.22,22.21 C408.1 ; X401.3 57.53,24.97 57.53,23.75 57.91,23.37
OSC_OUT: length 4.4
  Top Layer w0.1: 56.72,20.29 56.72,23.07 C409.2 56.68,24.62 X401.1
P_ADC_1: length 108.4
  Top Layer w0.2: v1(103,61.34) 98.64,61.34 v1(98.56,61.26) ; v1(128.78,63.15) R506.2 R505.1 132,62.93 C503.2 ; v1(50.8,20.32) 50.8,18.14 51.14,17.8 U401.15
  Bottom Layer w0.2: v1(98.56,61.26) 98.56,56.77 83.44,41.66 81.41,41.66 67.44,27.69 55.12,27.69 50.8,23.37 v1(50.8,20.32) ; v1(103,61.34) 126.97,61.34 v1(128.78,63.15)
P_ADC_2: length 120.9
  Top Layer w0.2: v1(105.03,50.67) 105.03,46.61 v1(98.17,39.75) ; C512.2 143.94,62.93 R618.1 R619.2 v1(140.84,63.15) ; 52.22,17.29 v1(50.93,17.29)
  Inner1 w0.2: v1(50.93,17.29) 51.94,18.31 51.94,25.02 55.63,28.7 61.72,28.7 70.23,37.21 v1(74.17,37.21)
  Inner2 w0.2: v1(74.17,37.21) 95.63,37.21 v1(98.17,39.75)
  Bottom Layer w0.2: v1(140.84,63.15) 130.4,52.7 107.06,52.7 v1(105.03,50.67)
P_ADC_3: length 132.9
  Top Layer w0.2: v1(97.41,40.64) 104.52,47.75 v1(104.52,49.28) ; v1(145.92,59.56) 149.78,59.56 R621.2 R620.1 155.24,62.93 C513.2 ; U401.17 v1(50.17,16.8)
  Inner1 w0.2: v1(73.79,37.97) 69.6,37.97 61.09,29.46 55.37,29.46 51.44,25.53 51.44,19.05 50.17,17.78 v1(50.17,16.8)
  Inner2 w0.2: v1(73.79,37.97) 94.74,37.97 v1(97.41,40.64)
  Bottom Layer w0.2: v1(104.52,49.28) 107.19,51.94 138.3,51.94 v1(145.92,59.56)
P_OUT_1: length 9.5
  Top Layer w0.2: R505.2 132.15,65.02 138.43,65.02 139.32,65.91 139.32,67.22 H501.1
P_OUT_2: length 9.8
  Top Layer w0.2: R618.2 150.51,64.66 151.26,65.41 151.26,67.22 H505.1
P_OUT_3: length 9.4
  Top Layer w0.2: H506.1 162.69,67.27 162.69,66.17 161.18,64.66 R620.2
PROGRAMME_R_A: length 30
  Top Layer w0.25: K102.3 116.5,30.61 v1(114.94,30.61)
  Bottom Layer w0.25: H504.1 103.02,7.62 114.94,19.54 v1(114.94,30.61)
PROGRAMME_R_B: length 35.2
  Top Layer w0.25: K102.6 v1(122.56,30.64)
  Bottom Layer w0.25: H504.2 115.57,18.1 115.57,29.34 116.87,30.64 v1(122.56,30.64)
RS232_1_RX: length 9.2
  Top Layer w0.2: U205.13 125.16,66.76 P508.2
RS232_1_TX: length 9.3
  Top Layer w0.2: U205.14 123.89,66.63 P508.3
RS485_A: length 78.3
  Top Layer w0.2: 108.65,11.19 108.65,8.68 H504.3
  Top Layer w0.25: 108.65,11.19 108.89,11.43 R207.2 108.66,12.73 U203.6
  Inner1 w0.2: v1(102.36,59.69) 98.32,63.73 93.76,63.73 91.43,66.06 91.43,67.09 P507.3 ; v1(100.46,15.11) 107.59,7.98 H504.3
  Bottom Layer w0.2: v1(100.46,15.11) 100.46,35.81 102.36,37.72 v1(102.36,59.69)
RS485_B: length 77.8
  Top Layer w0.2: R206.1 110.09,11.17 H504.4
  Top Layer w0.25: 109.93,14.55 109.93,12.67 R207.1 109.75,11.5 R206.1
  Inner1 w0.2: H504.4 109.09,7.62 v1(101.47,15.24) ; v1(103.5,59.82) 98.68,64.64 95.38,64.64 93.71,66.31 P507.2
  Bottom Layer w0.2: v1(101.47,15.24) 101.47,35.43 103.5,37.47 v1(103.5,59.82)
RS2251_A: length 47.8
  Top Layer w0.1: v1(79.5,20.07) 79.42,20.14 U202.11 ; U204.11 v1(80.01,12.29) ; 55.22,11.79 v1(55.22,9.78)
  Top Layer w0.2: R624.1 75.82,24.54 76.07,24.28 76.07,20.7 76.63,20.14 U202.11
  Bottom Layer w0.1: v1(55.22,9.78) 71.58,9.78 72.85,11.05 79.63,11.05 80.01,11.43 v1(80.01,12.29) 80.01,19.56 v1(79.5,20.07)
RS2251_B: length 46.7
  Top Layer w0.1: U202.10 79.19,19.49 v1(79.38,19.3) ; v1(54.74,10.29) 54.74,11.78 54.72,11.79 ; v1(79.38,11.68) 79.33,11.64 78.09,11.64
  Top Layer w0.2: R625.1 74.68,24.38 75.56,23.5 75.56,19.94 75.95,19.56 78.03,19.56 U202.10
  Bottom Layer w0.1: v1(54.74,10.29) 54.76,10.26 71.35,10.26 72.64,11.56 79.25,11.56 v1(79.38,11.68) v1(79.38,19.3)
RS2251_C: length 49.2
  Top Layer w0.1: 54.22,11.79 v1(54.22,10.67) ; U204.9 77.02,10.99 76.45,11.56 76.45,18.42 v1(76.84,18.8) 78.04,18.8 U202.9
  Top Layer w0.2: v1(76.84,18.8) 76.07,18.8 75.06,19.81 75.06,23.11 73.53,24.64 R626.1
  Bottom Layer w0.1: v1(54.22,10.67) 57.14,13.59 75.06,13.59 76.45,14.99 76.45,18.42 v1(76.84,18.8)
SENSER_A: length 38.6
  Top Layer w0.25: K101.3 v1(106.81,30.64)
  Bottom Layer w0.25: v1(106.81,30.64) 106.93,30.51 106.93,19.05 99.44,11.56 95.78,11.56 P501.2
  Bottom Layer w1: P501.1 P501.2
SENSER_B: length 31.7
  Top Layer w0.25: K101.6 109.78,30.61 v1(108.2,30.61)
  Bottom Layer w0.25: 97.17,7.62 107.7,18.15 107.7,30.1 v1(108.2,30.61)
  Bottom Layer w1: P501.3 P501.4
SWCLK: length 9.9
  Top Layer w0.1: P505.3 67.5,7.62 61.83,13.3 U401.37
SWDIO: length 10.5
  Top Layer w0.1: 58.22,11.79 58.22,9.84 59.04,9.02 64.41,9.02 P505.2
UART0_RX: length 35.5
  Top Layer w0.2: P504.3 56.72,9.12 56.72,11.79
  Top Layer w0.25: v1(30.73,18.42) 30.61,18.54 U501.6
  Bottom Layer w0.25: P504.3 53.19,9.65 51.69,9.65 45.34,16 33.15,16 30.61,18.54
UART0_TX: length 35.7
  Top Layer w0.2: P504.2 52.96,7.62 54.36,9.02 55.37,9.02 56.22,9.87 56.22,11.79
  Top Layer w0.25: v1(29.72,18.29) 29.34,18.67 U501.7
  Bottom Layer w0.25: v1(29.72,18.29) 32.64,15.37 45.09,15.37 52.72,7.73 P504.2
UART1_RX: length 150.9
  Top Layer w0.2: v1(53.59,18.67) 53.47,18.8 U401.13 ; P502.3 107.7,66.44 107.7,57.49 109.18,56.01 v1(109.2,56.01) ; H503.2 128.65,7.75 128.65,11.3 125.61,14.34 v1(125.61,18.21)
  Inner1 w0.2: v1(125.61,18.21) 125.61,48.02 117.62,56.01 v1(109.2,56.01)
  Bottom Layer w0.2: v1(53.59,18.67) 57.78,18.67 62.83,23.71 65.11,23.71 81.79,40.39 83.95,40.39 100.2,56.64 100.2,60.52 106.83,67.14 P502.3
UART1_TX: length 154.1
  Top Layer w0.2: 53.72,20.29 53.62,20.19 v1(53.09,20.19) ; v1(124.71,18.19) 124.71,12.57 125.98,11.3 H503.3 ; v1(110.49,55.37) 110.49,66.15 P502.2
  Inner1 w0.2: v1(124.71,18.19) 124.71,47.63 116.97,55.37 v1(110.49,55.37)
  Bottom Layer w0.2: v1(53.09,20.19) 53.09,19.81 53.72,19.18 57.4,19.18 62.51,24.29 64.93,24.29 81.66,41.02 83.69,41.02 99.57,56.9 99.57,65.41 103,68.83 107.8,68.83 P502.2
UART2_ESP32_RX: length 14.4
  Top Layer w0.2: v1(75.69,15.54) 75.69,11.68 78.1,9.27 79.25,9.27 80.9,7.62 P506.3
  Top Layer w0.25: U204.1 v1(73.91,15.54)
  Bottom Layer w0.25: v1(73.91,15.54) v1(75.69,15.54)
UART2_ESP32_TX: length 19.2
  Top Layer w0.2: U202.1 73.65,23.39 74.55,22.49 74.55,11.83 P506.2
UART2_RX: length 23
  Top Layer w0.2: v1(54.23,14.24) 52.27,14.24 U401.22 ; U204.3 v1(73.79,14.24)
  Bottom Layer w0.2: v1(73.79,14.24) v1(54.23,14.24)
UART2_TX: length 26
  Top Layer w0.2: U401.21 53.66,14.8 v1(53.72,14.86) ; U202.3 v1(73.79,22.09)
  Bottom Layer w0.2: v1(73.79,22.09) 66.55,14.86 v1(53.72,14.86)
USB_D+: length 1.9
  Top Layer w0.1: R503.1 28.19,14.46 28.07,14.59
USB_D-: length 1.8
  Top Layer w0.1: R504.1 U501.2
$1N1697: length 1.5
  Top Layer w0.25: R113.1 123.36,24.35 U103.4
$1N1702: length 10.2
  Top Layer w0.25: R113.2 124.83,21.34 125.22,20.95 125.94,20.95 125.96,20.97 128.15,20.97 R118.2 129.99,21.09 C107.2 131.65,21.14 R115.1
$1N2148: length 7.5
  Top Layer w0.25: R104.1 123.9,44.01 C104.2 122.25,44.06 R102.2 120.2,44.13 118.56,44.13 118.56,46.03 118.48,46.1
$1N2190: length 4.7
  Top Layer w0.25: R102.1 120.15,42.67 116.84,42.67 116.66,42.49 U102.4
$1N2193: length 5.6
  Top Layer w0.25: 116.98,46.1 116.66,45.78 116.66,44.13 116.46,43.93 R106.2 114.8,44.07 R103.1
$1N3772: length 4.3
  Top Layer w0.25: R107.1 99.69,34.81 R110.2 99.83,36.32 101.9,36.32 K101.1
$1N3874: length 4.1
  Top Layer w0.25: K102.1 116.36,36.2 R111.2 114.17,34.68 R108.1
$1N5503: length 4.1
  Top Layer w0.25: R109.1 128.77,36.32 R112.2 130.84,36.33 K103.1
$1N9152: length 4.1
  Top Layer w0.2: K606.1 146.14,36.23 R616.2 144.06,36.22 R617.1
$2N584: length 1.6
  Top Layer w0.25: R209.2 107.38,21.56 107.38,20.03
$2N588: length 3
  Top Layer w0.25: U203.1 111.23,20.06 111.23,21.72 112.35,21.72 112.5,21.56
$2N1547: length 2.9
  Top Layer w0.35: U205.1 121.35,50.65 C206.2
$2N1551: length 2.9
  Top Layer w0.35: U205.3 123.89,50.65 C206.1
$2N1557: length 4.8
  Top Layer w0.35: C205.2 122.3,54.74 122.62,54.41 U205.2
$2N1615: length 2.9
  Top Layer w0.35: U205.6 127.7,50.65 C208.1
$2N1744: length 2.7
  Top Layer w0.35: U205.4 125.16,50.15 C207.2
$2N1748: length 2.7
  Top Layer w0.35: U205.5 126.43,50.15 C207.1
$3N818: length 3.6
  Top Layer w0.25: U302.3 41.49,24.22 41.33,24.05 R302.2 41.33,21.37 C306.2
$3N819: length 5.3
  Top Layer w0.7: U302.5 44.33,26.1 C304.1 C305.1 49.46,26.1 R301.1
$3N960:
  vias: v1(12.95,72.26) v1(12.95,71.25) v1(14.11,71.25) v1(14.15,72.26) v1(15.38,72.26) v1(15.38,71.25) v1(16.77,72.26) v1(16.77,71.25) v1(16.77,69.89) v1(16.77,68.26) v1(16.77,66.63) v1(18.29,68.33) v1(19.72,68.33) v1(21.16,68.33) v1(22.6,68.33) v1(22.73,65.53)
$4N2174: length 0.9
  Top Layer w0.1: R402.1 65.09,14.88
$4N2187: length 1.6
  Top Layer w0.1: 65.66,23.99 64.35,23.99 D401.A
$4N3393: length 5.9
  Top Layer w0.2: Q1.3 62.23,35.21 BUZZER1.1
$4N3394: length 1.8
  Top Layer w0.2: Q1.1 63.84,40.86 R7.1
$4N5108: length 1.6
  Top Layer w0.2: D402.2 11.6,20.07 11.85,20.07 ; R622.2 11.85,20.07 ; 11.85,20.07 11.85,20.07
$4N5354: length 1.6
  Top Layer w0.2: D403.2 13.21,18.16 R623.2
$5N2667: length 7.5
  Top Layer w0.1: v1(29.59,6.73) 29.59,7.9 USB501.B6 ; R503.2 28.58,11.5 USB501.A6 v1(28.58,6.73)
  Bottom Layer w0.1: v1(28.58,6.73) v1(29.59,6.73)
$5N2668: length 10.1
  Top Layer w0.1: R501.2 22.48,8.33 22.48,5.97 23.24,5.21 26.8,5.21 27.58,5.99 USB501.A5
$5N2669: length 8.3
  Top Layer w0.1: USB501.B7 28.08,6.47 28.32,6.22 28.96,6.22 29.15,6.42 29.15,7.84 USB501.A7 29.08,7.92 29.08,11.63 R504.2
$5N2670: length 14.4
  Top Layer w0.1: USB501.B5 30.61,7.88 30.61,5.59 29.97,4.95 22.99,4.95 21.27,6.67 R502.2
$5N2672: length 9.5
  Top Layer w0.5: v1(31.24,10.03) v1(31.24,9.41) 31.24,7.93 31.23,7.91 ; USB501.A4B9 v1(26.43,9.38) v1(26.43,10.03)
  Top Layer w0.7: F501.2 36.13,10.6 C501.1 31.81,10.6 v1(31.24,10.03)
$5N2884: length 10.1
  Top Layer w0.7: 36.2,5.59 36.89,4.89 38.83,4.89 ; 36.2,5.59 36.2,4.83 H502.1 ; 36.2,5.59 F501.1
$5N3843: length 3.3
  Top Layer w0.5: R507.1 R508.2
  Top Layer w0.6: 38.83,6.79 38.61,7.02 R508.2
$6N449: length 4.4
  Top Layer w0.25: R604.1 167.61,54.45 K601.1 167.76,52.7 R607.2
$6N859: length 4.4
  Top Layer w0.25: R605.1 167.77,41.86 K602.1 167.91,40.12 R608.2
$6N1269: length 4.4
  Top Layer w0.25: 165.98,29.25 168.02,29.25 168.17,29.39 168.17,27.5 168,27.34
$6N1679: length 4.4
  Top Layer w0.25: 165.98,17.06 168.02,17.06 168.17,17.2 168.17,15.31 168,15.14
$6N2089: length 4.4
  Top Layer w0.25: R615.2 167.91,3.03 K605.1 167.77,4.78 R613.1

## Copper pours and planes (outline as drawn; the poured copper is in the pictures)
GND on Top Layer: -1.78,44.32 84.2,44.32 88.77,48.89 88.77,61.72 90.93,63.88 114.55,63.88 116.33,65.66 116.33,76.37 189.44,76.37 190.25,75.56 190.25,-1.02 188.47,-2.79 -1.52,-2.79 -4.06,-0.25 -4.06,42.04
GND on Bottom Layer: -1.78,44.32 84.2,44.32 88.77,48.89 88.77,61.72 90.93,63.88 114.55,63.88 116.33,65.66 116.33,76.37 189.44,76.37 190.25,75.56 190.25,-1.02 188.47,-2.79 -1.52,-2.79 -4.06,-0.25 -4.06,42.04
GND on Inner1: -1.78,44.32 84.2,44.32 88.77,48.89 88.77,61.72 90.93,63.88 114.55,63.88 116.33,65.66 116.33,76.37 189.44,76.37 190.25,75.56 190.25,-1.02 188.47,-2.79 -1.52,-2.79 -4.06,-0.25 -4.06,42.04
GND on Inner2: -1.78,44.32 84.2,44.32 88.77,48.89 88.77,61.72 90.93,63.88 114.55,63.88 116.33,65.66 116.33,76.37 189.44,76.37 190.25,75.56 190.25,-1.02 188.47,-2.79 -1.52,-2.79 -4.06,-0.25 -4.06,42.04
PGND on Top Layer: -2.41,77.98 116.08,77.98 116.33,77.72 116.33,65.53 114.81,64.01 91.31,64.01 88.9,61.59 88.9,49.02 84.2,44.32 -2.41,44.32
PGND on Bottom Layer: -2.41,77.98 116.08,77.98 116.33,77.72 116.33,65.53 114.81,64.01 91.31,64.01 88.9,61.59 88.9,49.02 84.2,44.32 -2.41,44.32
PGND on Inner1: -2.41,77.98 116.08,77.98 116.33,77.72 116.33,65.53 114.81,64.01 91.31,64.01 88.9,61.59 88.9,49.02 84.2,44.32 -2.41,44.32
PGND on Inner2: -2.41,77.98 116.08,77.98 116.33,77.72 116.33,65.53 114.81,64.01 91.31,64.01 88.9,61.59 88.9,49.02 84.2,44.32 -2.41,44.32
VCC_3V3 on Top Layer: 48.87,23.27 50.04,23.27 50.04,22.1 48.87,22.1
VCC_3V3 on Inner2: 48.87,23.27 50.04,23.27 50.04,22.1 48.87,22.1
VCC_5V on Top Layer: 44.32,29.91 46.48,29.91 46.48,28.45 44.32,28.45
VCC_5V on Inner1: 44.32,29.91 46.48,29.91 46.48,28.45 44.32,28.45
VCC_24V on Top Layer: 74.42,68.96 78.23,68.96 78.23,65.79 74.42,65.79
VCC_24V on Top Layer: 16.89,63.5 39.88,63.5 39.88,50.42 16.89,50.42
VCC_24V on Top Layer: 31.03,72.26 62.02,72.26 62.02,65.79 31.03,65.79
VCC_24V on Top Layer: 31.03,70.36 34.8,70.36 34.8,62.86 31.03,62.86
VCC_24V on Bottom Layer: 31.03,72.26 62.02,72.26 62.02,65.79 31.03,65.79
